# EAGLE design Oppressor_pcb (EAGLE 9.7.0)
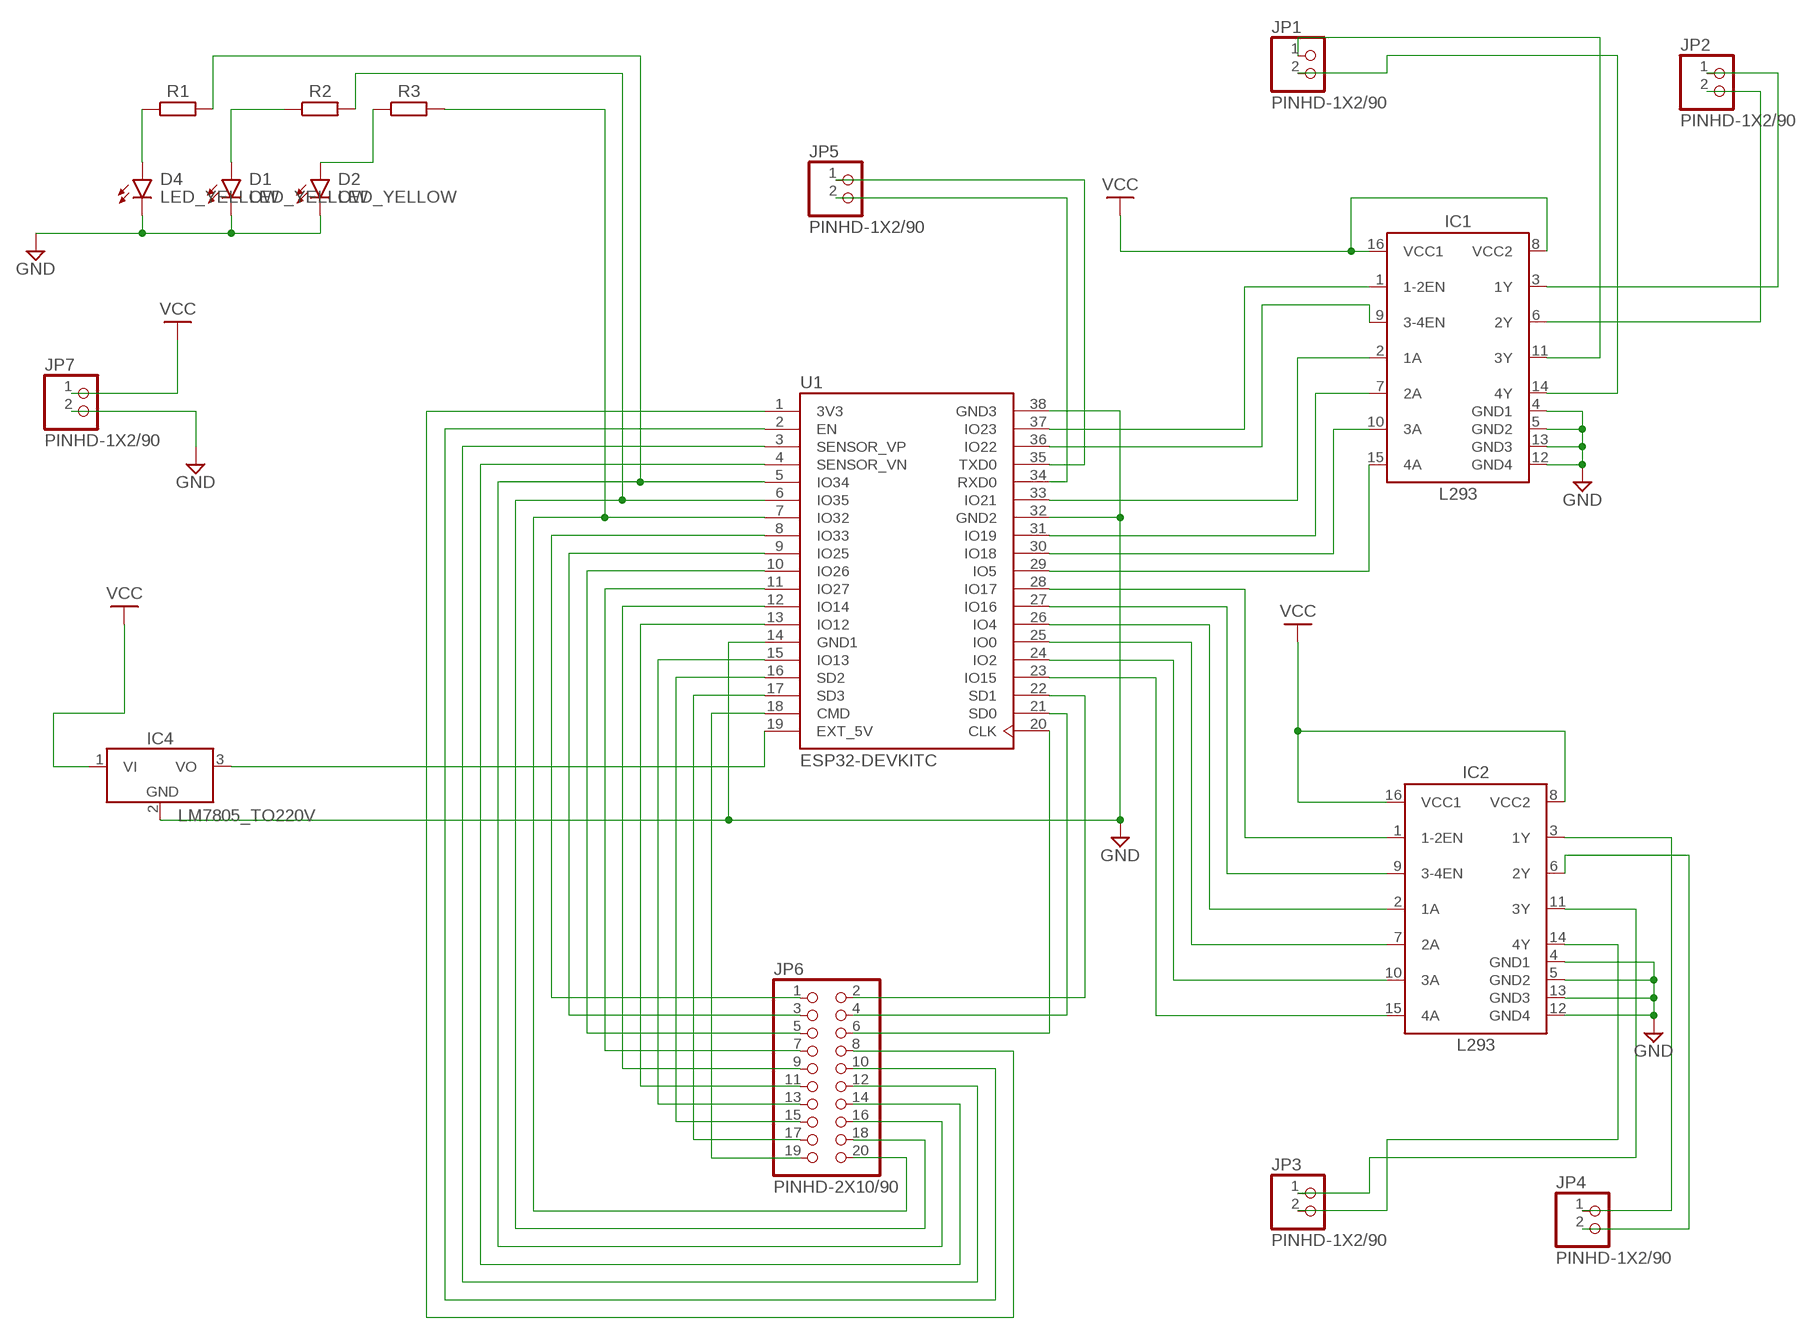
[diagram p0: schematic, sheet 1]

## Parts
D1  LED_YELLOW  CHIP-ROUND-Y_1209  [LEDC3224X250N_RND-Y]
D2  LED_YELLOW  CHIP-ROUND-Y_1209  [LEDC3224X250N_RND-Y]
D4  LED_YELLOW  CHIP-ROUND-Y_1209  [LEDC3224X250N_RND-Y]
IC1  L293  [DIP762W53P254L1969H508Q16B]
IC2  L293  [DIP762W53P254L1969H508Q16B]
IC4  LM7805_TO220V  [TO220V]
JP1  PINHD-1X2/90  [1X02/90]
JP2  PINHD-1X2/90  [1X02/90]
JP3  PINHD-1X2/90  [1X02/90]
JP4  PINHD-1X2/90  [1X02/90]
JP5  PINHD-1X2/90  [1X02/90]
JP6  PINHD-2X10/90  [2X10/90]
JP7  PINHD-1X2/90  [1X02/90]
R1  R_AXIAL-7.2MM-PITCH  [RESAD724W46L381D178B]
R2  R_AXIAL-7.2MM-PITCH  [RESAD724W46L381D178B]
R3  R_AXIAL-7.2MM-PITCH  [RESAD724W46L381D178B]
U1  ESP32-DEVKITC  [MODULE_ESP32-DEVKITC]

## Nets
GND: D1.C D2.C D4.C IC1.4(GND1) IC1.5(GND2) IC1.12(GND4) IC1.13(GND3) IC2.4(GND1) IC2.5(GND2) IC2.12(GND4) IC2.13(GND3) IC4.2(GND) JP7.2 U1.14(GND1) U1.32(GND2) U1.38(GND3)
N$1: IC2.3(1Y) JP4.1
N$2: IC2.6(2Y) JP4.2
N$3: IC2.11(3Y) JP3.1
N$4: IC2.14(4Y) JP3.2
N$5: IC1.3(1Y) JP2.1
N$6: IC1.6(2Y) JP2.2
N$7: IC1.11(3Y) JP1.1
N$8: IC1.14(4Y) JP1.2
N$9: IC4.3(VO) U1.19(EXT_5V)
N$10: IC1.1(1-2EN) U1.37(IO23)
N$11: IC1.9(3-4EN) U1.36(IO22)
N$12: IC1.2(1A) U1.33(IO21)
N$13: IC1.7(2A) U1.31(IO19)
N$14: IC1.10(3A) U1.30(IO18)
N$15: IC1.15(4A) U1.29(IO5)
N$16: IC2.1(1-2EN) U1.28(IO17)
N$17: IC2.9(3-4EN) U1.27(IO16)
N$18: IC2.2(1A) U1.26(IO4)
N$19: IC2.7(2A) U1.25(IO0)
N$20: IC2.10(3A) U1.24(IO2)
N$21: IC2.15(4A) U1.23(IO15)
N$22: JP5.1 U1.35(TXD0)
N$23: JP5.2 U1.34(RXD0)
N$24: JP6.2 U1.22(SD1)
N$25: JP6.4 U1.21(SD0)
N$26: JP6.6 U1.20(CLK)
N$27: JP6.17 U1.17(SD3)
N$28: JP6.19 U1.18(CMD)
N$29: JP6.15 U1.16(SD2)
N$30: JP6.13 U1.15(IO13)
N$31: JP6.11 U1.13(IO12)
N$32: JP6.9 U1.12(IO14)
N$33: JP6.7 U1.11(IO27)
N$34: JP6.5 U1.10(IO26)
N$35: JP6.3 U1.9(IO25)
N$36: JP6.1 U1.8(IO33)
N$40: JP6.14 U1.4(SENSOR_VN)
N$41: JP6.12 U1.3(SENSOR_VP)
N$42: JP6.10 U1.2(EN)
N$43: JP6.8 U1.1(3V3)
N$44: D4.A R1.1
N$45: D1.A R2.1
N$46: D2.A R3.1
N$47: JP6.16 R1.2 U1.5(IO34)
N$48: JP6.18 R2.2 U1.6(IO35)
N$49: JP6.20 R3.2 U1.7(IO32)
VCC: IC1.8(VCC2) IC1.16(VCC1) IC2.8(VCC2) IC2.16(VCC1) IC4.1(VI) JP7.1

## Library data of the parts
D1 D2 D4 = LED:CHIP-ROUND-Y; CATEGORY: LED; COLOR: YELLOW; DESCRIPTION: CHIP LED ROUND; SUB-CATEGORY: CHIP; TYPE: ROUND_TOP
IC1 IC2 = IC_Power-Management:L293: L293D H-bridge motor driver Datasheet <https://www.ti.com/lit/ds/symlink/l293.pdf>; CATEGORY: IC_Linear; DESCRIPTION: Bipolar Motor Driver; MANUFACTURER: Generic; MPN: Generic; SERIES: L293; SUB-CATEGORY: Motor Driver; TYPE: Bipolar
IC4 = IC_Power-Management:LM7805: 5V Voltage Regulator Reference Datasheet <https://www.ti.com/lit/ds/symlink/lm340.pdf>; CATEGORY: IC_Linear; DESCRIPTION: 5V Voltage Regulator; MANUFACTURER: Generic; MPN: Generic; SERIES: LM7805; SUB-CATEGORY: Voltage Regulator; TYPE: 5V
JP1-JP5 JP7 = Connector:PINHD-1X2: PIN HEADER; CATEGORY: Headers; DESCRIPTION: Header, Right Angle, 2 Position; MANUFACTURER: Generic; MPN: Generic; OPERATING_TEMPERATURE: Generic; PART_STATUS: Active; PITCH: 0.100" (2.54mm); ROHS_COMPLIANCE: Generic; SERIES: Generic; SUB-CATEGORY: Headers, Male Pins; TYPE: Board to Board or Cable, Unshrouded, Through Hole, Right Angle
JP6 = Connector:PINHD-2X10: PIN HEADER; CATEGORY: Headers; DESCRIPTION: Header, Right Angle, 2x10 Position; MANUFACTURER: Generic; MPN: Generic; OPERATING_TEMPERATURE: Generic; PART_STATUS: Active; PITCH: 0.100" (2.54mm); ROHS_COMPLIANCE: Generic; SERIES: Generic; SUB-CATEGORY: Headers, Male Pins; TYPE: Board to Board or Cable, Unshrouded, Through Hole, Right Angle
R1-R3 = Resistor:R: Resistor Fixed - Generic; CATEGORY: Resistor; SUB-CATEGORY: Fixed
U1 = SnapEDA Library:ESP32-DEVKITC: ESP32-DEVKITC; MANUFACTURER: ESPRESSIF; PARTREV: N/A; STANDARD: Manufacturer Recommendations

## Board
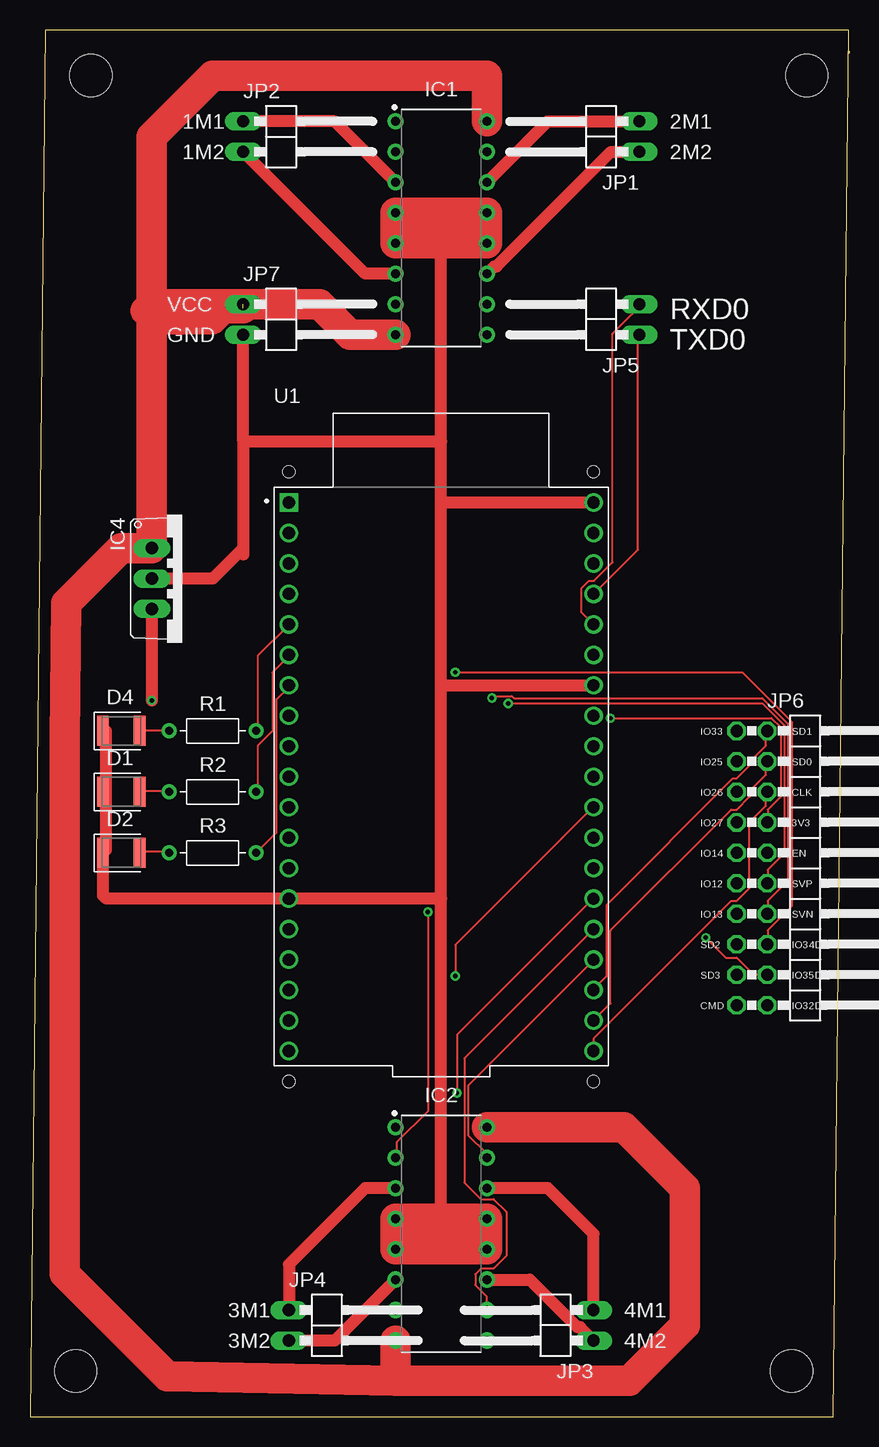
[diagram p1: board, top side]
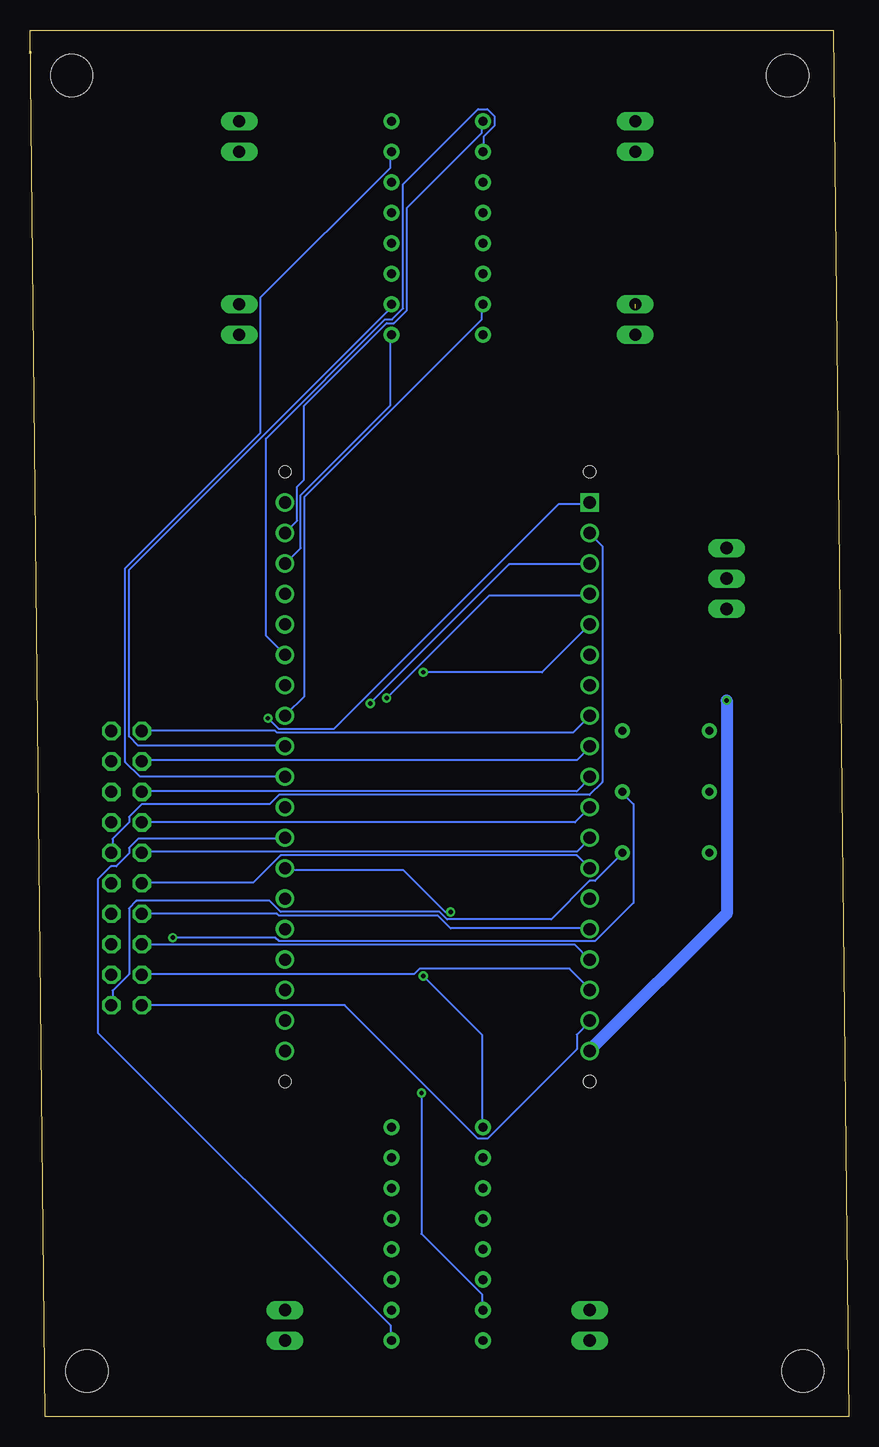
[diagram p2: board, bottom side, seen from below]

Size 68.25 x 115.56 mm. Coordinates in mm from the lower left corner, seen from the top.
Outline: 68.25,113.79 68.25,113.64
Outline: 0,0 66.98,0 68.25,115.56 1.27,115.56 0,0
Copper layers (1*16): Top 0.035mm / dielectric 1.5mm / Bottom 0.035mm
Design rules "default": minimum track width 6mil, minimum drill 0.35mm, track to track 6mil, track to pad 6mil, pad to pad 6mil, via to via 6mil, smd to smd 6mil, copper to edge 40mil, drill to drill 6mil, minimum pad ring 10mil, minimum via ring 8mil, stop-mask expansion 4mil, vias tented up to drill 0mil, thermal gap 10mil
Holes 3.5 mm at 3.81,3.81 63.5,3.81 64.77,111.76 5.08,111.76
Holes 1 mm at 21.59,78.74 46.99,78.74 46.99,27.94 21.59,27.94

### Footprints (pad centres in the part's own frame; a part is rotated, then mirrored left to right if it is on the bottom)
LEDC3224X250N_RND-Y = smd 0.962 x 2.512: A 1.525,0; C -1.525,0
DIP762W53P254L1969H508Q16B = drill 0.743 pad 1.343: 1 -3.81,8.89; 2 -3.81,6.35; 3 -3.81,3.81; 4 -3.81,1.27; 5 -3.81,-1.27; 6 -3.81,-3.81; 7 -3.81,-6.35; 8 -3.81,-8.89; 9 3.81,-8.89; 10 3.81,-6.35; 11 3.81,-3.81; 12 3.81,-1.27; 13 3.81,1.27; 14 3.81,3.81; 15 3.81,6.35; 16 3.81,8.89
TO220V = drill 1.016 long: 1 -2.54,-2.54; 2 0,-2.54; 3 2.54,-2.54
1X02/90 = drill 1.016 long: 1 -1.27,-3.81; 2 1.27,-3.81
2X10/90 = drill 1.016 octagon: 1 -11.43,-6.35; 2 -11.43,-3.81; 3 -8.89,-6.35; 4 -8.89,-3.81; 5 -6.35,-6.35; 6 -6.35,-3.81; 7 -3.81,-6.35; 8 -3.81,-3.81; 9 -1.27,-6.35; 10 -1.27,-3.81; 11 1.27,-6.35; 12 1.27,-3.81; 13 3.81,-6.35; 14 3.81,-3.81; 15 6.35,-6.35; 16 6.35,-3.81; 17 8.89,-6.35; 18 8.89,-3.81; 19 11.43,-6.35; 20 11.43,-3.81
RESAD724W46L381D178B = drill 0.66 pad 1.26: 1 -3.62,0; 2 3.62,0
MODULE_ESP32-DEVKITC = drill 1.02 square: 1 -12.7,22.85 | drill 1.02: 2 -12.7,20.31; 3 -12.7,17.77; 4 -12.7,15.23; 5 -12.7,12.69; 6 -12.7,10.15; 7 -12.7,7.61; 8 -12.7,5.07; 9 -12.7,2.53; 10 -12.7,-0.01; 11 -12.7,-2.55; 12 -12.7,-5.09; 13 -12.7,-7.63; 14 -12.7,-10.17; 15 -12.7,-12.71; 16 -12.7,-15.25; 17 -12.7,-17.79; 18 -12.7,-20.33; 19 -12.7,-22.87; 20 12.7,-22.87; 21 12.7,-20.33; 22 12.7,-17.79; 23 12.7,-15.25; 24 12.7,-12.71; 25 12.7,-10.17; 26 12.7,-7.63; 27 12.7,-5.09; 28 12.7,-2.55; 29 12.7,-0.01; 30 12.7,2.53; 31 12.7,5.07; 32 12.7,7.61; 33 12.7,10.15; 34 12.7,12.69; 35 12.7,15.23; 36 12.7,17.77; 37 12.7,20.31; 38 12.7,22.85

### Placement (x,y rotation side)
D1  7.62,52.07 0 top
D2  7.62,46.99 0 top
D4  7.62,57.15 0 top
IC1  34.29,99.06 0 top
IC2  34.29,15.24 0 top
IC4  12.7,69.85 270 top
JP1  46.99,106.68 90 top
JP2  21.59,106.68 270 top
JP3  43.18,7.62 90 top
JP4  25.4,7.62 270 top
JP5  46.99,91.44 90 top
JP6  65.28,45.72 270 top
JP7  21.59,91.44 270 top
R1  15.24,57.15 0 top
R2  15.24,52.07 0 top
R3  15.24,46.99 0 top
U1  34.29,53.34 0 top

### Tracks (layer width: path | path; a pad name or v marks a point on that pad's centre or on a via)
GND
  Top 0.152: 6.35,52.12 6.2,52.12 D1.C | D4.C 6.35,57.15
  Top 1.016: 34.29,16.51 34.29,43.18 | 34.29,43.18 34.29,60.96 | 34.29,60.96 34.29,76.2 | 34.29,76.2 34.29,81.28 | 34.29,81.28 34.29,97.79 | 17.78,81.28 JP7.2 | 17.78,81.28 17.78,72.39 | 17.78,72.39 17.78,71.86 | 17.78,81.28 34.29,81.28 | 34.29,76.2 U1.38 | 34.29,60.96 U1.32 | 34.29,43.18 34.28,43.17 U1.14 6.36,43.17 6.09,43.44 D2.C 6.35,47.25 6.35,52.12 6.35,57.15 | 17.78,72.39 15.24,69.85 IC4.2
  Top 2.54: IC1.13 IC1.4 IC1.5 34.29,97.79 IC1.12 IC1.13 | IC2.4 34.29,16.51 IC2.13 IC2.12 IC2.5 IC2.4
N$1
  Top 1.016: IC2.3 27.94,19.05 21.59,12.7 JP4.1
N$2
  Top 1.016: IC2.6 25.4,6.35 JP4.2
N$3
  Top 1.016: JP3.1 45.87,7.47 45.64,7.47 41.68,11.43 IC2.11
N$4
  Top 1.016: JP3.2 46.99,15.24 43.18,19.05 IC2.14
N$5
  Top 1.016: IC1.3 25.4,107.95 JP2.1
N$6
  Top 1.016: IC1.6 27.94,95.25 JP2.2
N$7
  Top 1.016: IC1.11 38.71,95.86 38.9,95.86 48.45,105.41 JP1.1
N$8
  Top 1.016: IC1.14 43.18,107.95 JP1.2
N$9  (via drill 0.35)
  Top 1.016: IC4.3 v10.16,59.69
  Bottom 0.152: U1.19
  Bottom 1.016: v10.16,59.69 10.16,41.91 U1.19
N$10
  Bottom 0.152: IC1.1 30.58,107.9 30.58,106.98 36.83,100.74 36.83,92.2 37.9,91.13 38.51,91.13 45.4,84.24 45.4,78.08 45.97,77.5 45.97,74.68 46.89,73.76 U1.37
N$11
  Bottom 0.152: IC1.9 38.2,90.07 38.2,84.28 45.67,76.81 45.67,72.39 46.89,71.17 U1.36
N$12
  Bottom 0.152: IC1.2 30.43,105.46 30.43,106.68 29.51,107.59 29.51,108.36 30.12,108.97 30.89,108.97 37.14,102.72 37.14,92.35 38.05,91.44 38.66,91.44 48.58,81.52 48.58,65.09 47.04,63.55 U1.33
N$13
  Bottom 0.152: IC1.7 30.58,92.66 30.58,91.44 45.36,76.66 45.36,60.05 46.89,58.52 U1.31
N$14
  Bottom 0.152: IC1.10 38.2,92.66 38.2,92.35 59.99,70.56 59.99,56.69 59.23,55.93 47.04,55.93 U1.30
N$15
  Bottom 0.152: IC1.15 38.2,105.31 38.2,104.09 49.02,93.27 49.02,81.99 60.3,70.71 60.3,54.56 59.08,53.34 47.04,53.34 U1.29
N$16  (via drill 0.35)
  Top 0.152: v35.46,36.73 35.46,39.32 46.89,50.75 U1.28
  Bottom 0.152: v35.46,36.73 30.58,31.85 30.58,24.23 IC2.1
N$17
  Bottom 0.152: IC2.9 38.2,6.4 38.2,7.62 62.59,32 62.59,44.81 61.52,45.87 61.06,45.87 59.99,46.94 59.99,47.4 59.23,48.16 47.04,48.16 U1.27
N$18  (via drill 0.35)
  Top 0.152: v33.17,42.06 33.17,25.45 30.58,22.86 30.58,21.64 IC2.2
  Bottom 0.152: v33.17,42.06 33.63,42.06 37.14,45.57 46.89,45.57 U1.26
N$19  (via drill 0.35)
  Top 0.152: v35.61,26.98 35.61,31.85 46.89,43.13 U1.25
  Bottom 0.152: v35.61,26.98 35.61,15.24 30.58,10.21 30.58,8.99 IC2.7
N$20
  Top 0.152: IC2.10 38.05,8.99 38.05,10.06 37.14,10.97 37.14,11.89 37.59,12.34 38.66,12.34 39.73,13.41 39.73,17.07 38.66,18.14 37.59,18.14 36.22,19.51 36.22,29.87 46.89,40.54 U1.24
N$21
  Top 0.152: IC2.15 38.05,21.64 38.05,21.95 36.52,23.47 36.52,27.58 46.89,37.95 U1.23
N$22
  Top 0.152: JP5.1 50.7,90.07 50.7,72.24 47.04,68.58 U1.35
N$23
  Top 0.152: JP5.2 50.7,92.66 50.7,92.35 48.58,90.24 48.58,71.19 47.04,69.65 46.58,69.65 45.97,69.04 45.97,67.06 46.89,66.14 U1.34
N$24
  Top 0.152: JP6.2 61.37,57.15 61.37,55.93 59.99,54.56 59.99,54.25 58.93,53.19 58.62,53.19 48.11,42.67 48.11,36.73 47.04,35.66 U1.22
N$25
  Top 0.152: JP6.4 61.37,54.56 61.37,53.49 59.99,52.12 59.99,51.66 58.93,50.6 58.47,50.6 48.41,40.54 48.41,34.44 47.04,33.07 U1.21
N$26
  Top 0.152: JP6.6 61.37,51.97 61.37,50.9 59.99,49.53 59.99,44.04 58.93,42.98 58.47,42.98 47.04,31.55 47.04,30.48 U1.20
N$27
  Bottom 0.152: JP6.17 58.93,36.88 36.22,36.88 35.76,37.34 23.27,37.34 21.59,35.66 U1.17
N$28
  Bottom 0.152: JP6.19 42.01,34.29 30.89,23.16 30.12,23.16 22.66,30.63 22.66,31.85 21.59,32.92 U1.18
N$29
  Bottom 0.152: JP6.15 58.93,39.32 22.81,39.32 U1.16
N$30
  Bottom 0.152: JP6.13 47.65,41.91 47.5,41.76 34.24,41.76 33.17,40.69 21.59,40.69 U1.15
N$31
  Bottom 0.152: JP6.11 58.93,44.5 49.63,44.5 47.35,46.79 22.66,46.79 U1.13
N$32
  Bottom 0.152: JP6.9 58.93,47.09 22.66,47.09 21.59,48.16 U1.12
N$33
  Bottom 0.152: JP6.7 22.81,49.53 21.59,50.75 U1.11
N$34
  Bottom 0.152: JP6.5 58.93,52.12 22.66,52.12 21.59,53.19 U1.10
N$35
  Bottom 0.152: JP6.3 58.93,54.71 22.66,54.71 21.59,55.78 U1.9
N$36
  Bottom 0.152: JP6.1 47.8,57.15 47.65,57 22.96,57 21.59,58.37 U1.8
N$40  (via drill 0.35)
  Top 0.152: v38.51,59.89 38.66,60.05 40.18,60.05 40.33,59.89 61.06,59.89 63.19,57.76 63.19,44.65 61.52,42.98 61.52,41.91 JP6.14
  Bottom 0.152: v38.51,59.89 29.97,68.43 21.59,68.43 U1.4
N$41  (via drill 0.35)
  Top 0.152: v39.88,59.44 61.06,59.44 62.89,57.61 62.89,46.94 61.52,45.57 61.52,44.5 JP6.12
  Bottom 0.152: v39.88,59.44 28.3,71.02 21.59,71.02 U1.3
N$42
  Bottom 0.152: JP6.10 61.37,47.09 61.37,48.16 59.99,49.53 59.99,49.99 58.93,51.05 48.26,51.05 47.5,51.82 21.59,51.82 20.52,52.88 20.52,72.54 21.59,73.61 U1.2
N$43  (via drill 0.35)
  Top 0.152: v48.41,58.22 61.82,58.22 62.59,57.46 62.59,51.66 61.52,50.6 61.52,49.53 JP6.8
  Bottom 0.152: v48.41,58.22 47.5,57.3 42.93,57.3 24.18,76.05 21.59,76.05 U1.1
N$44
  Top 0.152: R1.1 D4.A
N$45
  Top 0.152: D1.A 9.25,52.12 11.53,52.12 R2.1
N$46
  Top 0.152: D2.A 9.25,47.09 11.53,47.09 R3.1
N$47  (via drill 0.35)
  Top 0.152: R1.2 19,57.15 19,63.4 21.59,65.99 U1.5 | v35.46,62.03 59.38,62.03 63.5,57.91 63.5,42.52 61.52,40.54 61.52,39.47 JP6.16
  Bottom 0.152: v35.46,62.03 25.55,62.03 21.59,65.99 U1.5
N$48  (via drill 0.35)
  Top 0.152: R2.2 19,52.12 19,55.93 20.22,57.15 20.22,62.03 21.59,63.4 U1.6 | v56.34,39.93 58.01,38.25 58.93,38.25 60.3,36.88 61.37,36.88 JP6.18
  Bottom 0.152: v56.34,39.93 47.8,39.93 47.5,39.62 21.13,39.62 17.93,42.82 17.93,51.05 18.85,51.97 R2.2
N$49
  Top 0.152: U1.7 21.59,60.81 20.52,59.74 20.52,48.65 R3.2
  Bottom 0.152: JP6.20 61.37,34.29 61.37,35.51 59.99,36.88 59.99,42.37 59.38,42.98 48.26,42.98 47.35,42.06 34.09,42.06 33.48,41.45 24.79,41.45 21.59,44.65 21.13,44.65 18.85,46.94 R3.2
VCC  (1 unrouted)
  Top 2.54: 10.16,92.71 JP7.1 24.13,92.71 26.67,90.17 IC1.8 | 10.16,92.71 9.62,92.17 | 10.16,92.71 10.16,106.68 15.24,111.76 38.1,111.76 IC1.16 | 30.49,2.99 11.45,3.36 2.91,11.9 2.91,56.44 3.03,67.8 7.62,72.39 IC4.1 10.16,91.44 15.2,91.44 16.11,92.35 17.78,92.35 | 30.49,2.99 | 30.49,2.99 IC2.8 | 30.49,2.99 49.98,2.99 54.61,7.62 54.61,19.05 49.53,24.13 IC2.16

### Text on the board
tNames: 1M1 | 2M1 | 1M2 | 2M2 | RXD0 | VCC | TXD0 | GND | IO33 | SD1 | IO25 | SD0 | IO26 | CLK | IO27 | 3V3 | IO14 | EN | IO12 | SVP | IO13 | SVN | SD2 | IO34D | SD3 | IO35D | CMD | IO32D | 3M1 | 4M1 | 3M2 | 4M2